# EAGLE design 2014-12-5_2.2_lcd_V1.0.0.4 (EAGLE 7.1.0)
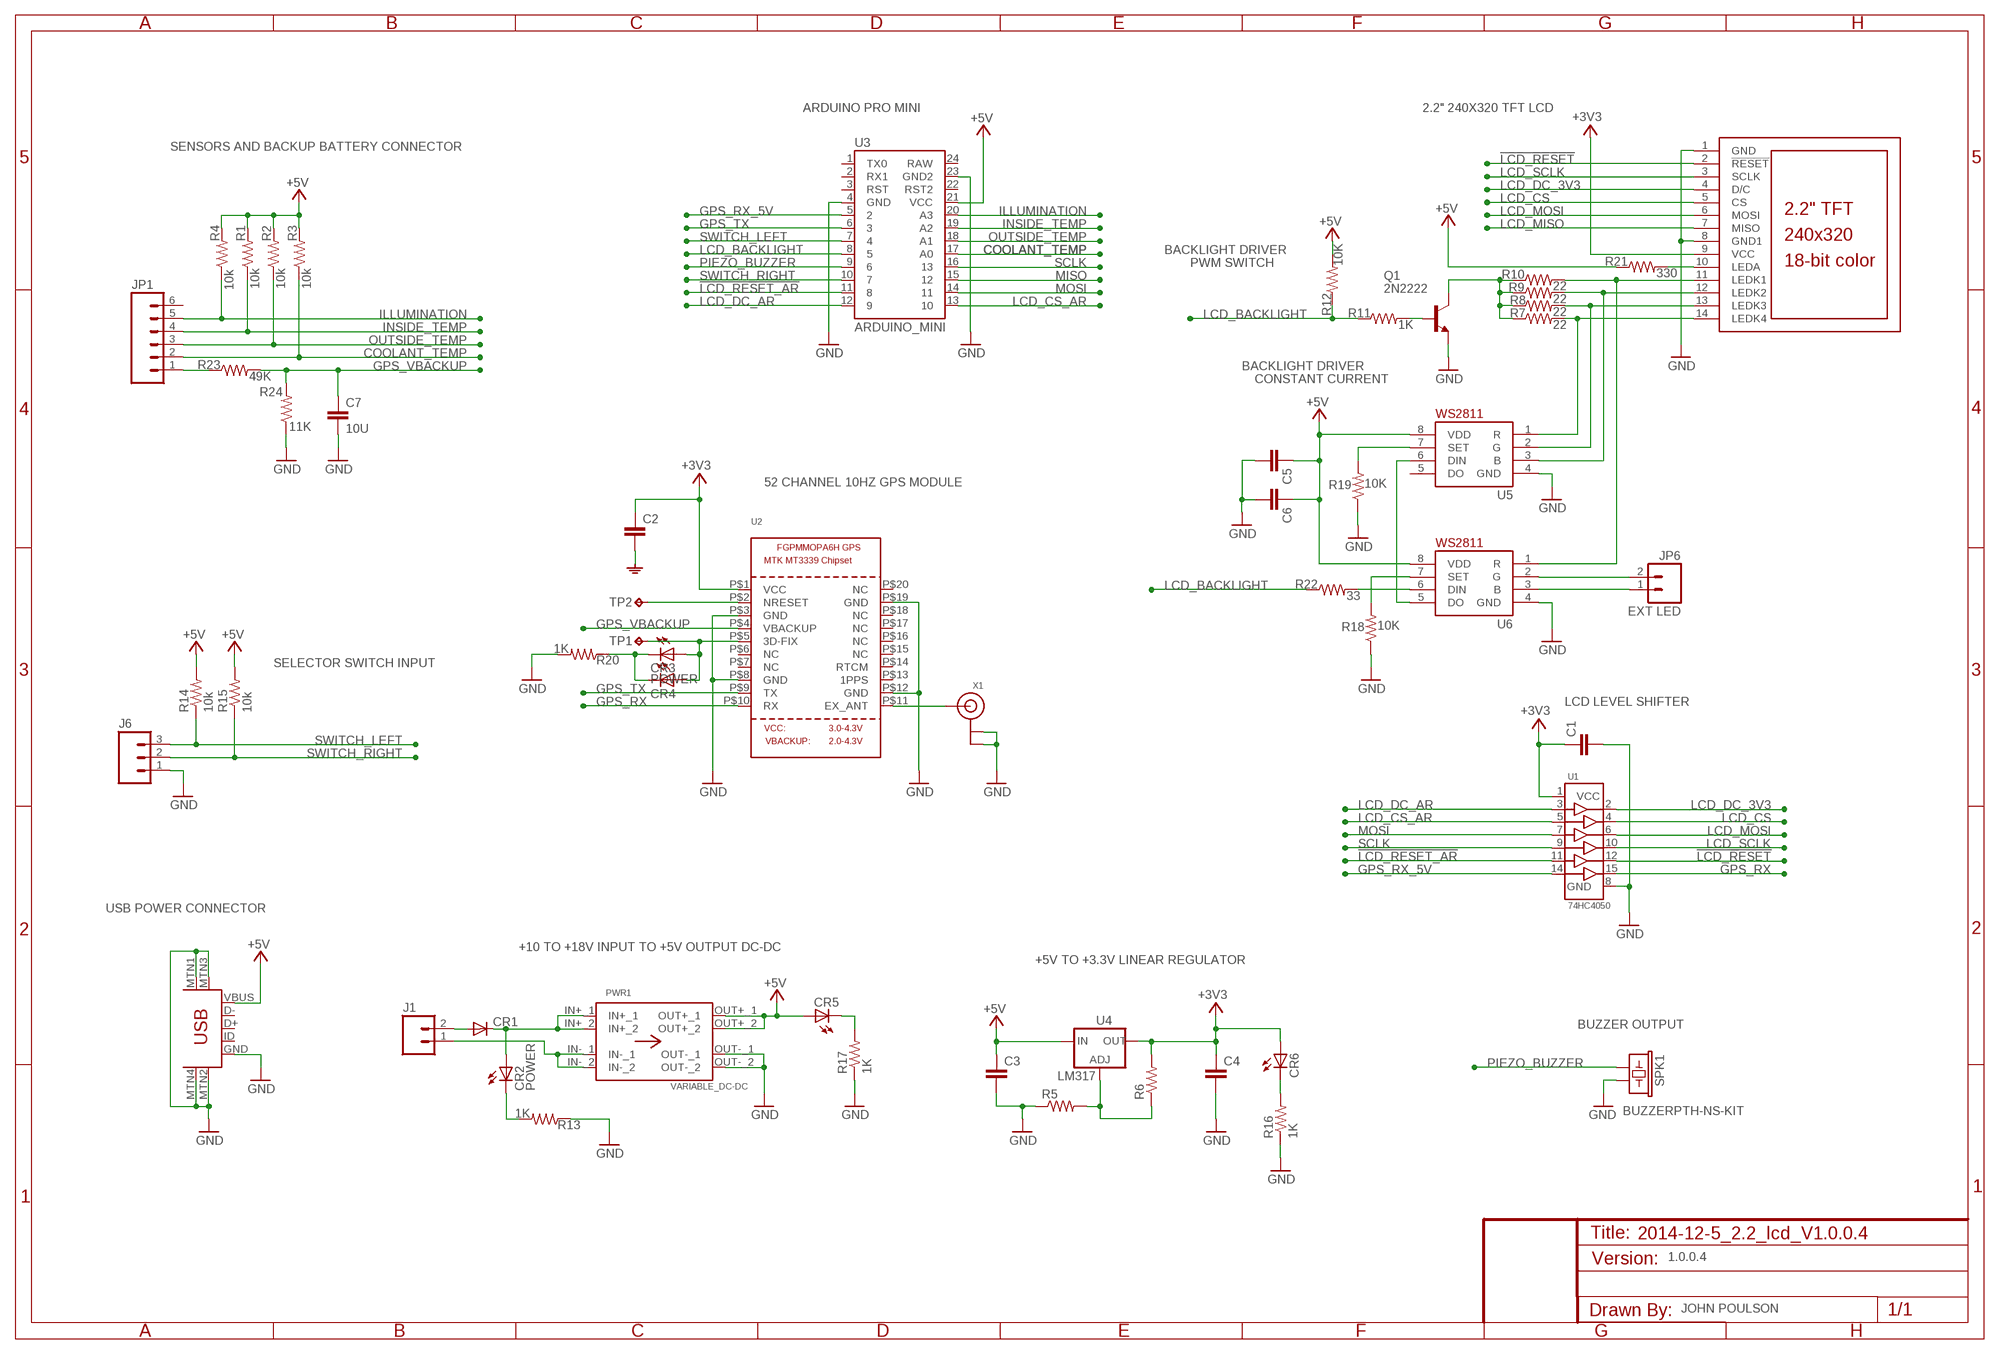
[diagram p0: schematic, sheet 1]

## Parts
C1  CAP0805  [0805]
C2  CAP0805  [0805]
C3  CAP0805  [0805]
C4  CAP0805  [0805]
C5  CAP0805  [0805]
C6  CAP0805  [0805]
C7  10U  CAP0805  [0805]
CR1  DIODESMB  [SMB-DIODE]
CR2  POWER  LED3MM  [LED3MM]
CR3  POWER  LED3MM  [LED3MM]
CR4  LED0603  [LED-0603]
CR5  LED0603  [LED-0603]
CR6  LED0603  [LED-0603]
J1  M02POLAR  [MOLEX-1X2]
J6  M03POLAR  [MOLEX-1X3]
JP1  M06POLAR  [MOLEX-1X6]
JP6  EXT LED  M02POLAR  [MOLEX-1X2]
PWR1  VARIABLE_DC-DC  [VARIABLE_DC-DC]
Q1  2N2222  [TO92]
R1  10k  RESISTOR0805-RES  [0805]
R2  10k  RESISTOR0805-RES  [0805]
R3  10k  RESISTOR0805-RES  [0805]
R4  10k  RESISTOR0805-RES  [0805]
R5  RESISTOR0805-RES  [0805]
R6  RESISTOR0805-RES  [0805]
R7  22  RESISTOR0805-RES  [0805]
R8  22  RESISTOR0805-RES  [0805]
R9  22  RESISTOR0805-RES  [0805]
R10  22  RESISTOR0805-RES  [0805]
R11  1K  RESISTOR0805-RES  [0805]
R12  10K  RESISTOR0805-RES  [0805]
R13  1K  RESISTOR0805-RES  [0805]
R14  10k  RESISTOR0805-RES  [0805]
R15  10k  RESISTOR0805-RES  [0805]
R16  1K  RESISTOR0805-RES  [0805]
R17  1K  RESISTOR0805-RES  [0805]
R18  10K  RESISTOR0805-RES  [0805]
R19  10K  RESISTOR0805-RES  [0805]
R20  1K  RESISTOR0805-RES  [0805]
R21  330  RESISTOR0805-RES  [0805]
R22  33  RESISTOR0805-RES  [0805]
R23  49K  RESISTOR0805-RES  [0805]
R24  11K  RESISTOR0805-RES  [0805]
SPK1  BUZZERPTH-NS-KIT  [BUZZER-12MM-NS-KIT]
TP1  TPPAD1-13  [P1-13]
TP2  TPPAD1-13  [P1-13]
U1  74HC4050  [SO16]
U2  GPS_FGPMMOPA6H  [FGPMMOPA6H]
U3  ARDUINO_MINI  [ARDUINO_MINI]
U4  LM317  V_REG_317SMD  [SOT223]
U5  WS2811-SOP8  [SO08-SKINNYPADS]
U6  WS2811-SOP8  [SO08-SKINNYPADS]
U$2  2.2_LCD  [2.2_LCD]
USB  USB-MINIB-5PIN  [USB-MINIB]
X1  ANTENNA_U.FL  [U.FL]

## Nets
!LCD_RESET: U1.12 U$2.2(!RESET)
!LCD_RESET_AR: U1.11 U3.11
+3V3: C1.1 C2.1 C4.1 CR6.A R6.2 U1.1(VCC) U2.P$1(VCC) U4.2(OUT) U$2.9(VCC)
+5V: C3.1 C5.1 C6.1 CR5.A PWR1.OUT+_1 PWR1.OUT+_2 R1.2 R2.2 R3.2 R4.2 R12.2 R14.2 R15.2 R21.1 U3.21(VCC) U4.3(IN) U5.8(VDD) U6.8(VDD) USB.VBUS
COOLANT_TEMP: JP1.2 R3.1 U3.17(A0)
GND: C1.2 C3.2 C4.2 C5.2 C6.2 C7.2 J6.1 PWR1.OUT-_1 PWR1.OUT-_2 Q1.1(E) R5.1 R13.1 R16.1 R17.1 R18.1 R19.1 R20.2 R24.1 SPK1.- U1.8(GND) U2.P$3(GND) U2.P$8(GND) U2.P$12(GND) U2.P$19(GND) U3.4(GND) U3.23(GND2) U5.4(GND) U6.4(GND) U$2.1(GND) U$2.8(GND1) USB.GND USB.MTN1(MTN2) USB.MTN2(MTN3) USB.MTN3(MTN1) USB.MTN4 X1.1(GND) X1.2(GND)
GPS_RX: U1.15 U2.P$10(RX)
GPS_RX_5V: U1.14 U3.5
GPS_TX: U2.P$9(TX) U3.6
GPS_VBACKUP: C7.1 R23.2 R24.2 U2.P$4(VBACKUP)
ILLUMINATION: JP1.5 R4.1 U3.20(A3)
INSIDE_TEMP: JP1.4 R1.1 U3.19(A2)
LCD_BACKLIGHT: R11.1 R12.1 R22.1 U3.8
LCD_CS: U1.4 U$2.5(CS)
LCD_CS_AR: U1.5 U3.13
LCD_DC_3V3: U1.2 U$2.4(D/C)
LCD_DC_AR: U1.3 U3.12
LCD_MISO: U$2.7(MISO)
LCD_MOSI: U1.6 U$2.6(MOSI)
LCD_SCLK: U1.10 U$2.3(SCLK)
MISO: U3.15
MOSI: U1.7 U3.14
N$1: TP2.TP U2.P$2(NRESET)
N$2: U2.P$11(EX_ANT) X1.3(SIGNAL)
N$3: R7.2 U5.1(R) U$2.14(LEDK4)
N$4: R8.2 U5.2(G) U$2.13(LEDK3)
N$5: R9.2 U5.3(B) U$2.12(LEDK2)
N$6: R5.2 R6.1 U4.1(ADJ)
N$7: R10.2 U6.1(R) U$2.11(LEDK1)
N$8: Q1.3(C) R7.1 R8.1 R9.1 R10.1
N$9: Q1.2(B) R11.2
N$10: CR1.A J1.2
N$11: CR1.C CR2.A PWR1.IN+_1 PWR1.IN+_2
N$12: J1.1 PWR1.IN-_1 PWR1.IN-_2
N$13: JP6.2 U6.2(G)
N$15: R21.2 U$2.10(LEDA)
N$16: CR3.K(C) CR4.C R20.1
N$17: CR2.K(C) R13.2
N$18: CR3.A CR4.A TP1.TP U2.P$5(3D-FIX)
N$19: CR6.C R16.2
N$20: CR5.C R17.2
N$21: U5.6(DIN) U6.5(DO)
N$22: R18.2 U6.7(SET)
N$23: JP6.1 U6.3(B)
N$24: R19.2 U5.7(SET)
N$25: R22.2 U6.6(DIN)
N$26: JP1.1 R23.1
OUTSIDE_TEMP: JP1.3 R2.1 U3.18(A1)
P$1: C2.2 ; supply symbol labelled GND
PIEZO_BUZZER: SPK1.+ U3.9
SCLK: U1.9 U3.16
SWITCH_LEFT: J6.3 R14.1 U3.7
SWITCH_RIGHT: J6.2 R15.1 U3.10
Unconnected: JP1.6 U2.P$6(NC) U2.P$7(NC) U2.P$13(1PPS) U2.P$14(RTCM) U2.P$15(NC) U2.P$16(NC) U2.P$17(NC) U2.P$18(NC) U2.P$20(NC) U3.1(TX0) U3.2(RX1) U3.3(RST) U3.22(RST2) U3.24(RAW) U5.5(DO) USB.D+ USB.D- USB.ID

## Notes on the sheet
- ARDUINO PRO MINI | 2.2" 240X320 TFT LCD
- SENSORS AND BACKUP BATTERY CONNECTOR
- BACKLIGHT DRIVER
- PWM SWITCH
- BACKLIGHT DRIVER
- CONSTANT CURRENT
- 52 CHANNEL 10HZ GPS MODULE
- SELECTOR SWITCH INPUT
- LCD LEVEL SHIFTER
- USB POWER CONNECTOR
- +10 TO +18V INPUT TO +5V OUTPUT DC-DC
- +5V TO +3.3V LINEAR REGULATOR
- BUZZER OUTPUT
- 1.0.0.4
- JOHN POULSON

## Library data of the parts
C1-C4 C7 = SparkFun-Passives:CAP: Capacitor Standard 0603 ceramic capacitor, and 0.1" leaded capacitor.
C5 C6 = SparkFun-Capacitors:CAP: Capacitor Standard 0603 ceramic capacitor, and 0.1" leaded capacitor.
CR1 = SparkFun-DiscreteSemi:DIODE: Diode These are standard reverse protection diodes and small signal diodes. SMA package can handle up to about 1A. SOD-323 can handle about 200mA. What the SOD-323 package when ordering, there are some mfgs out there that are 5-pin packages.
CR2-CR6 = SparkFun-LED:LED: LEDs Standard schematic elements and footprints for 5mm, 3mm, 1206, and 0603 sized LEDs. 5mm - Spark Fun Electronics SKU : COM-00529 (and others)
J1 JP6 = SparkFun-Connectors:M02: Header 2 Standard 2-pin 0.1" header. Use with straight break away headers (SKU : PRT-00116), right angle break away headers (PRT-00553), swiss pins (PRT-00743), machine pins (PRT-00117), and female headers (PRT-00115). Molex polarized connector foot print use with SKU : PRT-08233 with associated crimp pins and housings.
J6 = SparkFun-Connectors:M03: Header 3 Standard 3-pin 0.1" header. Use with straight break away headers (SKU : PRT-00116), right angle break away headers (PRT-00553), swiss pins (PRT-00743), machine pins (PRT-00117), and female headers (PRT-00115). Molex polarized connector foot print use with SKU : PRT-08232 with associated crimp pins and housings.
JP1 = SparkFun-Connectors:M06: Header 6 Standard 6-pin 0.1" header. Use with straight break away headers (SKU : PRT-00116), right angle break away headers (PRT-00553), swiss pins (PRT-00743), machine pins (PRT-00117), and female headers (PRT-00115). Molex polarized connector foot print use with SKU : PRT-08094 with associated crimp pins and housings. NOTES ON THE VARIANTS LOCK and LOCK_LONGPADS... This footprint was designed to help hold the alignment of a through-hole component (i.e. 6-pin header) while soldering it into place. You may notice that each hole has been shifted either up or down by 0.005 of an inch from it's more standard position (which is a perfectly straight line). This slight alteration caused the pins (the squares in the middle) to touch the edges of the holes. Because they are alternating, it causes a "brace" to hold the component in place. 0.005 has proven to be the perfect amount of "off-center" position when using our standard breakaway headers. Although looks a little odd when you look at the bare footprint, once you have a header in there, the alteration is very hard to notice. Also,if you push a header all the way into place, it is covered up entirely on the bottom side. This idea of altering the position of holes to aid alignment will be further integrated into the Sparkfun Library for other footprints. It can help hold any component with 3 or more connection pins.
PWR1 = !EXTRON:VARIABLE_DC-DC
Q1 = adafruit:2N2222: NPN TRANSISTOR Big oval pads
R1-R24 = SparkFun-Passives:RESISTOR: Resistor Basic schematic elements and footprints for 0603, 1206, and PTH resistors.
SPK1 = SparkFun-Electromechanical:BUZZER: Buzzer 12mm Spark Fun Electronics SKU : Comp-Buzzer
TP1 TP2 = testpad:TP: Test pad
U1 = !EXTRON:74HC4050
U2 = adafruit:GPS_FGPMMOPA6H: GPS Module - MTK MT3339 Chipset, -165dBm sensitivity, 22 channels, 10Hz, auto-select external antenna options
U3 = SparkFun-Boards:ARDUINO_MINI: Arduino Pro Mini footprint
U4 = SparkFun-PowerIC:V_REG_317: Voltage Regulator Standard LM317 adjustable voltage regulator. AOI (Adjust Output Input). Google 'LM317 Calculator' for easy to use app to get the two resistor values needed. 240/720 for 5V output. 240/390 for 3.3V output. Spark Fun Electronics SKU : COM-00527
U5 U6 = adafruit:WS2811
U$2 = !EXTRON:2.2_LCD
USB = SparkFun-Connectors:USB-MINIB: Mini-USB "B" connector with 5th pin broken out. Created new symbol breaking out 5th "ID" pin in mini/micro USB connector spec. See: http://en.wikipedia.org/wiki/Mini_usb#Cables. Uses same footprint as 4-pin symbol. Also added pins to connect to mounting / shield pads if required (probably not generally needed as signals aren't shielded once they leave the connector).
X1 = adafruit:ANTENNA_U.FL: U.FL Antenna Connector

## Board
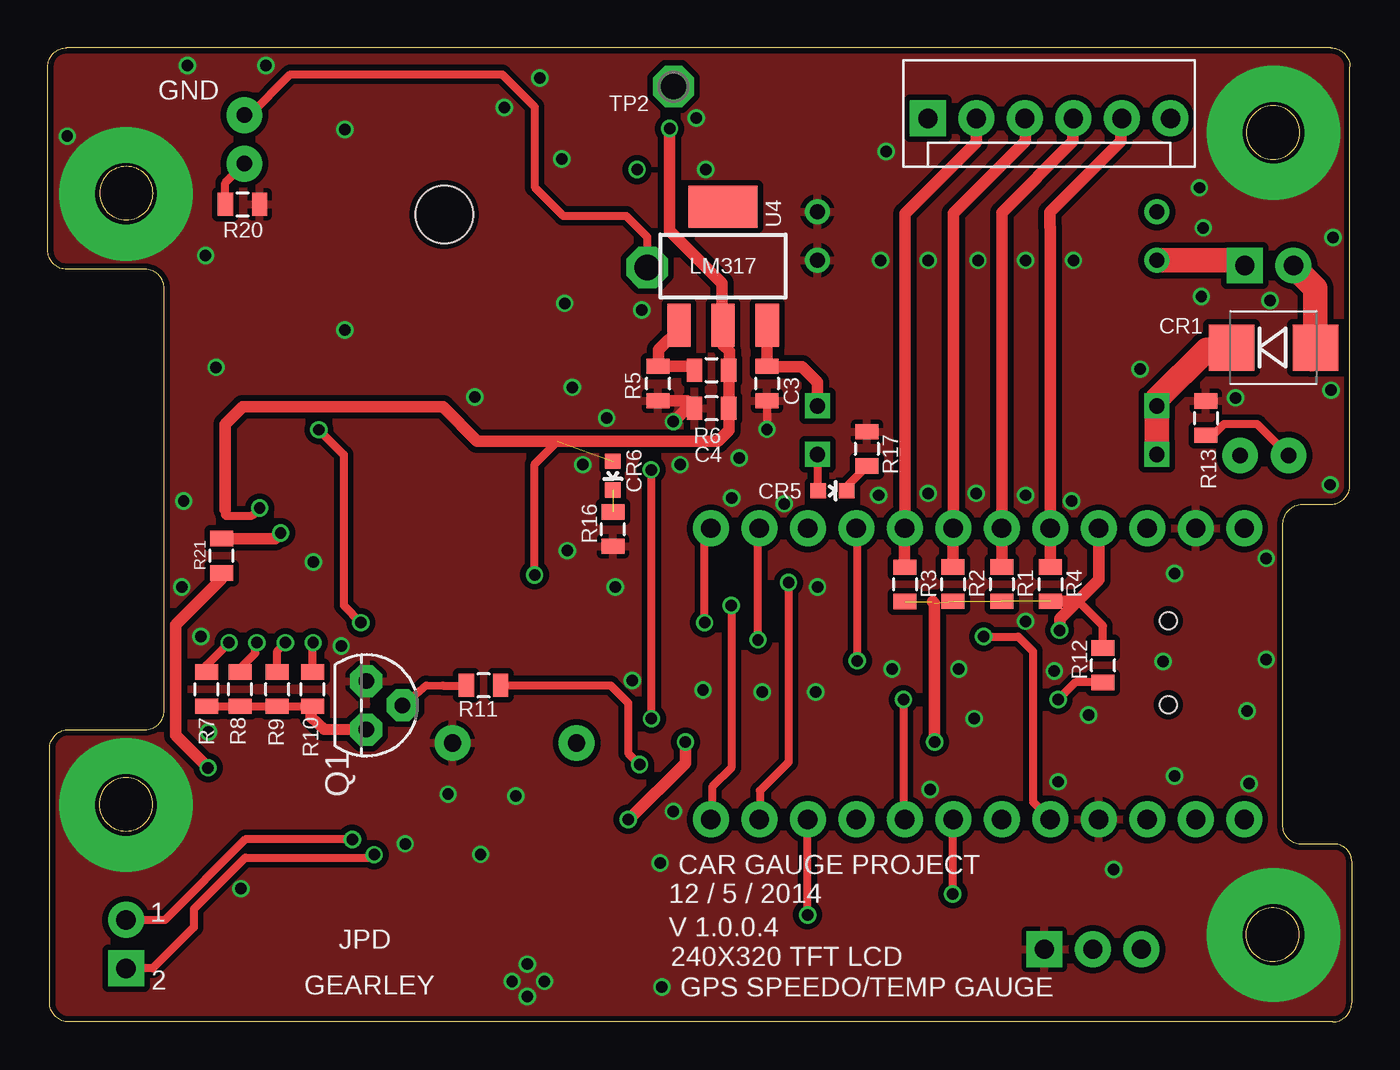
[diagram p1: board, top side]
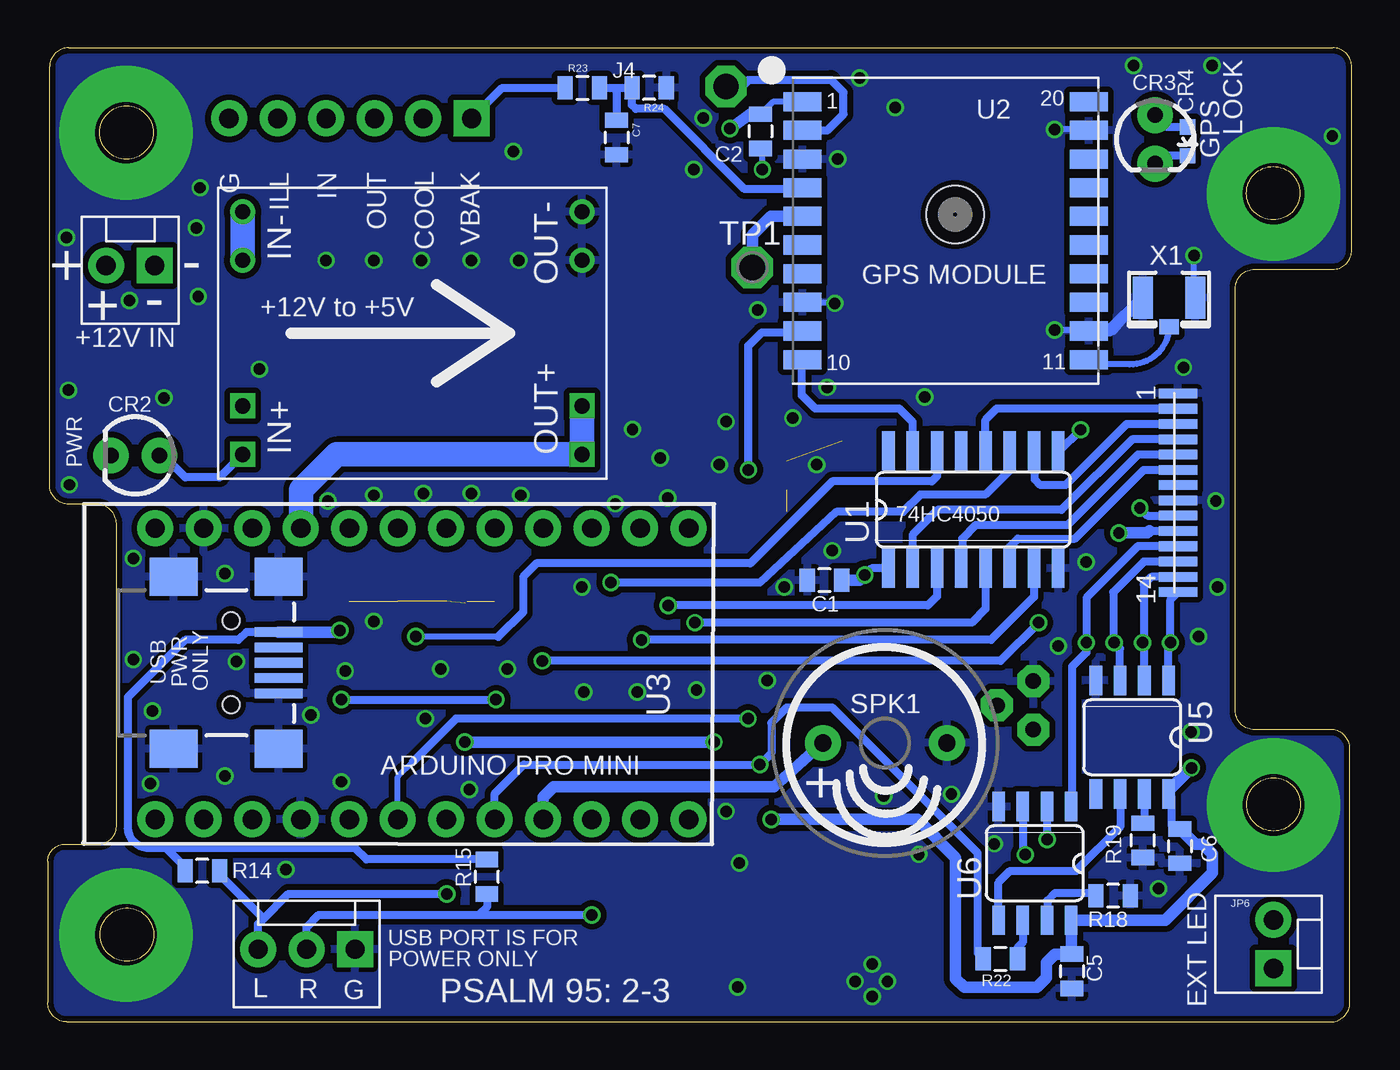
[diagram p2: board, bottom side, seen from below]

Size 68.3 x 51 mm. Coordinates in mm from the lower left corner, seen from the top.
Outline: 5.52,43.39 arc180 2.71,43.39 arc180 5.52,43.39
Outline: 5.5,11.39 arc180 2.7,11.39 arc180 5.5,11.39
Outline: 65.55,4.56 arc180 62.75,4.56 arc180 65.55,4.56
Outline: 65.58,46.56 arc180 62.78,46.56 arc180 65.58,46.56
Outline: 68.2,28.1 68.2,50 arc90 67.2,51 1,51 arc90 0,50 0,40.4 arc90 1,39.4 5.1,39.4 arc-90 6.1,38.4 6.1,16.3 arc-90 5.1,15.3 1.1,15.3 arc90 0.1,14.3 0.1,1 arc90 1.1,0 67.3,0 arc90 68.3,1 68.3,8.4 arc90 67.4,9.3 65.6,9.3 arc-90 64.7,10.3 64.7,26 arc-90 65.7,27.1 67.2,27.1 arc90 68.2,28.1
Copper layers (1*16): Top 0.035mm / dielectric 1.5mm / Bottom 0.035mm
Design rules "dirt_cheap_dirty_boards.v1": minimum track width 5mil, minimum drill 12mil, track to track 5mil, track to pad 5mil, pad to pad 5mil, via to via 5mil, smd to smd 0mil, copper to edge 10mil, drill to drill 10mil, minimum pad ring 10mil, minimum via ring 6mil, stop-mask expansion 2mil, vias tented up to drill 25mil, thermal gap 10mil

### Footprints (pad centres in the part's own frame; a part is rotated, then mirrored left to right if it is on the bottom)
0805 = smd 0.8 x 1.2: 1 -0.9,0; 2 0.9,0
SMB-DIODE = smd 2.4 x 2.4: A 2.2,0; C -2.2,0
LED3MM = drill 0.813 pad 1.88: A -1.27,0; K 1.27,0
LED-0603 = smd 0.8 x 0.8: A 0,-0.75; C 0,0.75
MOLEX-1X2 = drill 1.016 pad 1.88 square: 1 0,0 | drill 1.016 pad 1.88: 2 2.54,0
MOLEX-1X3 = drill 1.016 pad 1.88 square: 1 0,0 | drill 1.016 pad 1.88: 2 2.54,0; 3 5.08,0
MOLEX-1X6 = drill 1.016 pad 1.88 square: 1 0,0 | drill 1.016 pad 1.88: 2 2.54,0; 3 5.08,0; 4 7.62,0; 5 10.16,0; 6 12.7,0
VARIABLE_DC-DC = drill 0.8 square: IN+_1 -10.16,7.62; IN+_2 -7.62,7.62; OUT+_1 -10.16,-10.16; OUT+_2 -7.62,-10.16 | drill 0.8: IN-_1 0,7.62; IN-_2 2.54,7.62; OUT-_1 0,-10.16; OUT-_2 2.54,-10.16
TO92 = drill 0.813 pad 1.676 octagon: 1 -1.27,0; 2 0,1.905; 3 1.27,0
BUZZER-12MM-NS-KIT = drill 0.9 pad 1.88: + 3.25,0; - -3.25,0
P1-13 = drill 1.321 pad 2.159 octagon: TP 0,0
SO16 = smd 0.66 x 2.032: 1 -4.445,-3.073; 2 -3.175,-3.073; 3 -1.905,-3.073; 4 -0.635,-3.073; 5 0.635,-3.073; 6 1.905,-3.073; 7 3.175,-3.073; 8 4.445,-3.073; 9 4.445,3.073; 10 3.175,3.073; 11 1.905,3.073; 12 0.635,3.073; 13 -0.635,3.073; 14 -1.905,3.073; 15 -3.175,3.073; 16 -4.445,3.073
FGPMMOPA6H = smd 2 x 1: P$1 -7.5,6.75; P$2 -7.5,5.25; P$3 -7.5,3.75; P$4 -7.5,2.25; P$5 -7.5,0.75; P$6 -7.5,-0.75; P$7 -7.5,-2.25; P$8 -7.5,-3.75; P$9 -7.5,-5.25; P$10 -7.5,-6.75; P$11 7.5,-6.75; P$12 7.5,-5.25; P$13 7.5,-3.75; P$14 7.5,-2.25; P$15 7.5,-0.75; P$16 7.5,0.75; P$17 7.5,2.25; P$18 7.5,3.75; P$19 7.5,5.25; P$20 7.5,6.75 | hole 3: 0.5,0.85
ARDUINO_MINI = drill 1.016 pad 1.88: 1 -7.62,12.7; 2 -7.62,10.16; 3 -7.62,7.62; 4 -7.62,5.08; 5 -7.62,2.54; 6 -7.62,0; 7 -7.62,-2.54; 8 -7.62,-5.08; 9 -7.62,-7.62; 10 -7.62,-10.16; 11 -7.62,-12.7; 12 -7.62,-15.24; 13 7.62,-15.24; 14 7.62,-12.7; 15 7.62,-10.16; 16 7.62,-7.62; 17 7.62,-5.08; 18 7.62,-2.54; 19 7.62,0; 20 7.62,2.54; 21 7.62,5.08; 22 7.62,7.62; 23 7.62,10.16; 24 7.62,12.7
SOT223 = smd 1.219 x 2.235: 1 -2.311,-3.099; 2 0,-3.099; 3 2.311,-3.099 | smd 3.6 x 2.2: 4 0,3.099
SO08-SKINNYPADS = smd 0.66 x 1.524: 1 -1.905,-2.973; 2 -0.635,-2.973; 3 0.635,-2.973; 4 1.905,-2.973; 5 1.905,2.973; 6 0.635,2.973; 7 -0.635,2.973; 8 -1.905,2.973
2.2_LCD = smd 0.5 x 2: 1 5.2,-0.4; 2 4.4,-0.4; 3 3.6,-0.4; 4 2.8,-0.4; 5 2,-0.4; 6 1.2,-0.4; 7 0.4,-0.4; 8 -0.4,-0.4; 9 -1.2,-0.4; 10 -2,-0.4; 11 -2.8,-0.4; 12 -3.6,-0.4; 13 -4.4,-0.4; 14 -5.2,-0.4
USB-MINIB = smd 2.5 x 0.5: D+ 2.5,0; D- 2.5,0.8; GND 2.5,-1.6; ID 2.5,-0.8; VBUS 2.5,1.6 | smd 2.5 x 2: MTN1 -3,4.5; MTN2 2.5,4.5; MTN3 -3,-4.5; MTN4 2.5,-4.5 | hole 0.9: 0,2.2; 0,-2.2
U.FL = smd 2.2 x 1.05: 1 0,1.375; 2 0,-1.375 | smd 0.8 x 1: 3 1.525,0

### Placement (x,y rotation side)
C1  27.62,23.12 180 bottom
C2  30.97,46.62 270 bottom
C3  37.67,33.42 270 top
C4  34.77,32.12 180 top
C5  14.65,2.65 270 bottom
C6  9,9.2 270 bottom
C7  38.5,46.3 270 bottom
CR1  64.2,35.3 0 top
CR2  63.72,29.65 180 bottom
CR3  10.3,46.2 270 bottom
CR4  8.6,46.1 180 bottom
CR5  41.1,27.8 270 top
CR6  29.6,28.6 180 top
J1  62.7,39.6 180 bottom
J6  52.2,3.8 180 bottom
JP1  46.1,47.3 0 top
JP6  4.1,2.8 90 bottom
PWR1  50.47,39.87 90 bottom
Q1  16.68,16.57 270 top
R1  49.97,22.92 270 top
R2  47.42,22.92 270 top
R3  44.9,22.9 270 top
R4  52.52,22.92 270 top
R5  31.97,33.42 90 top
R6  34.77,34.12 0 top
R7  8.32,17.42 90 top
R8  10.07,17.42 90 top
R9  12.02,17.42 90 top
R10  13.87,17.42 90 top
R11  22.82,17.62 180 top
R12  55.27,18.67 90 top
R13  60.66,31.61 270 top
R14  60.2,7.9 180 bottom
R15  45.3,7.6 90 bottom
R16  29.6,25.8 90 top
R17  42.9,30 270 top
R18  12.5,6.6 180 bottom
R19  10.95,9.5 90 bottom
R20  10.2,42.8 0 top
R21  9.1,24.4 90 top
R22  18.4,3.3 0 bottom
R23  40.3,48.9 0 bottom
R24  36.8,48.9 180 bottom
SPK1  24.45,14.6 180 bottom
TP1  31.4,39.5 0 bottom
TP2  32.77,48.97 180 top
U1  19.82,26.82 0 bottom
U2  21.27,41.42 0 bottom
U3  49.97,18.22 90 bottom
U4  35.37,39.57 0 top
U5  11.5,14.9 180 bottom
U6  16.6,8.3 180 bottom
U$2  9.5,27.7 90 bottom
USB  58.7,18.8 0 bottom
X1  9.57,37.92 270 bottom

### Tracks (layer width: path | path; a pad name or v marks a point on that pad's centre or on a via)
!LCD_RESET
  Bottom 0.406: U1.12 19.18,31.52 18.6,32.1 U$2.2
!LCD_RESET_AR  (via drill 0.6)
  Top 0.406: v38.8,23 38.8,13.6 37.3,12.1 37.3,10.63 U3.11
  Bottom 0.406: U1.11 17.91,28.89 19.2,27.6 22.6,27.6 23.5,26.7 27,26.7 31,23 v38.8,23
+3V3  (via drill 0.6)  (1 unrouted)
  Top 0.406: v25.5,23.4 25.5,29.2 26.7,30.4 | 9.3,26.8 9.3,26.5 10.7,26.5 v11.1,26.9
  Top 0.61: v32.57,46.77 32.57,41.42 35.32,38.67 35.32,36.52 U4.2 35.37,35.43 35.7,35.1 35.7,34.15 R6.2 C4.1 35.67,30.97 35.1,30.4 26.7,30.4 22.5,30.4 20.7,32.2 10.2,32.2 9.3,31.3 9.3,26.8
  Bottom 0.305: U2.P$1 30.32,48.17 C2.1
  Bottom 0.406: U1.1 25.15,23.75 v25.5,23.4 | v11.1,26.9 10.7,26.5 U$2.9
  Bottom 0.61: C2.1 31.52,47.52 v32.57,46.77 | C1.1 25.78,23.12 v25.5,23.4
+5V  (via drill 0.6)  (4 unrouted)
  Top 0.406: v30.4,10.6 30.45,10.6 | 46.45,21.92 46.35,22.02 | CR5.A 40.35,29.67 PWR1.OUT+_1 | R12.2 55.27,20.73 53.95,22.05
  Top 0.61: U3.21 55.05,23.15 53.95,22.05 53.92,22.02 | 53.92,22.02 R4.2 | U4.3 C3.1 37.69,34.3 39.5,34.3 40.32,33.48 PWR1.OUT+_2 | 30.45,10.6 33.4,13.55 v33.4,14.65 | v46.45,14.65 46.45,21.92 | 46.33,22 46.35,22.02 | v53,20.5 53,21.1 53.92,22.02 | R21.1 9.1,23.2 6.7,20.8 6.7,15 v8.4,13.3
  Bottom 0.406: 62.1,9.1 52.2,9.1 51.6,8.5 R15.2 | 62.1,9.1 63,9.1 arc90 64.1,10.2 64.1,17 61.1,20 58.3,20 57.89,20.41 57.88,20.4 USB.VBUS | U5.8 9.45,11.78 9.45,10.4 | 9.45,10.4 C6.1 | 14.7,3.65 C5.1 14.7,3.75 | 9.45,10.4 9.45,10.3 | U6.8 | R14.2 61.1,8.1 62.1,9.1
  Bottom 0.61: v33.4,14.65 v46.45,14.65 | 14.7,3.75 U6.8 9.77,5.33 7.3,7.8 7.3,8.8 7.8,9.3 8.2,9.3 C6.1 | v30.4,10.6 22.75,10.6 20.75,8.6 20.75,2.25 20.3,1.8 16.5,1.8 16,2.3 16,3.1 15.55,3.55 C5.1 | 53.09,20.41 v53,20.5 53.1,20.4 USB.VBUS | U5.8 9.6,12.11 v8.4,13.3
  Bottom 1.27: U3.21 55.02,25.87 55.02,27.87 53.18,29.71 PWR1.OUT+_1 PWR1.OUT+_2
COOLANT_TEMP
  Top 0.61: R3.1 44.87,23.83 44.87,25.82 U3.17 44.89,40.6 44.9,40.61 44.9,42.3 48.64,46.04 JP1.2
GND  (via drill 0.6, 3.2 pad 7)
  Top 0.406: C3.2 v37.67,31.02
  Top 0.61: R5.1 33.47,32.52 C4.2 33.47,32.12 v32.77,31.42
  Bottom 0.305: X1.2 12.47,36.12 | X1.1 8.27,37.22 v8.27,40.12 | U2.P$12 14.57,36.22 v15.57,36.22 | U2.P$19 14.47,46.72 v15.57,46.72 | U2.P$8 27.22,37.67 v27.07,37.62
  Bottom 0.61: U2.P$12 12.7,36.17 X1.2
  other vias: 15.37,19.67 36.22,29.52 35.82,27.42 48.52,15.87 32.77,11.02 25.77,49.42 38.57,27.12 62.82,16.27 24.52,11.82 20.97,11.92 22.67,8.77 18.72,9.32 25.12,3.02 67.17,28.12 59.02,12.87 32.17,1.82 4.1,43.35 4.1,11.35 64.2,46.55 64.2,4.55 59.02,23.47 44.22,18.47 40.32,22.77 40.22,17.27 34.32,17.37 30.62,17.87 8.42,15.17 7.12,27.27 13.92,24.07 8.82,34.27 28.02,29.17 33.12,29.17 31.12,37.27 7.32,50.07 1.02,46.37 26.92,45.17 60.32,43.67 43.92,45.57 46.12,39.87 48.72,39.87 43.62,39.87 51.22,39.87 53.72,39.87 43.52,27.57 53.62,27.27 51.22,27.57 48.62,27.67 46.12,27.67 47.72,18.47 46.22,12.17 37.42,17.27 27.22,24.67 55.82,7.97 32.07,8.32 52.92,12.57 63.82,24.27 62.92,12.47 63.82,18.97 58.42,18.87 54.52,16.07 60.42,37.97 67.22,33.07 62.22,32.67 57.22,34.17 64.02,37.77 67.32,41.07 60.52,41.57 22.37,32.72 29.27,31.62 27.47,33.22 29.72,22.77 11.42,50.07 23.92,47.87 33.97,47.32 34.47,44.62 52.72,18.37 51.22,20.97 10.12,6.97 25.12,1.32 26.02,2.12 24.32,2.12 8.02,20.17 7.02,22.77
  pour Bottom (isolate 0.305): 0.17,50.97 68.12,50.92 68.12,0.12 0.22,0.17 0.15,50.99
  pour Top (isolate 0.305): 0.17,0.12 0.17,50.97 68.12,50.92 68.12,0.12
GPS_RX
  Bottom 0.406: U1.15 22.99,31.39 23.7,32.1 28.1,32.1 28.8,32.8 28.8,34.64 U2.P$10
GPS_RX_5V  (via drill 0.6)
  Top 0.406: 52.47,10.64 U3.5 51.6,11.51 51.6,19.4 50.83,20.17 v49.02,20.17
  Bottom 0.305: 52.47,10.64 U3.5 | 44.7,20.15 49,20.15 v49.02,20.17
  Bottom 0.406: U1.14 21.72,28.57 22,28.3 27.2,28.3 31.5,24 42.7,24 43.4,23.3 43.4,21.45 44.7,20.15
GPS_TX  (via drill 0.6)
  Top 0.406: v31.62,15.87 31.62,28.88 v31.6,28.9
  Bottom 0.305: U3.6 49.97,12.82 49.17,13.62 | 28.82,36.12 U2.P$9
  Bottom 0.406: v31.62,15.87 46.92,15.87 49.17,13.62 | v31.6,28.9 31.6,35.4 30.9,36.1 28.84,36.1 U2.P$9
GPS_VBACKUP
  Bottom 0.406: U2.P$4 28.84,43.6 31.8,43.6 36,47.8 37.5,47.8 37.7,48 R24.2 R23.2 38.7,48.9 38.5,48.7 C7.1
ILLUMINATION
  Top 0.61: R4.1 U3.20 52.51,41.59 52.5,41.6 52.5,42.4 56.2,46.1 56.2,47.24 JP1.5
INSIDE_TEMP
  Top 0.61: R1.1 U3.19 | U3.19 50.1,25.97 | JP1.4 53.7,47.28 53.7,46.1 49.97,42.37 U3.19
LCD_BACKLIGHT  (via drill 0.6)
  Top 0.406: v44.82,16.87 44.82,10.67 U3.8 | R11.1 29.48,17.62 30.4,16.7 30.4,14.07 v31,13.47 | R12.1 53.82,17.77 v52.92,16.87
  Bottom 0.406: U3.8 44.89,11.95 43.37,13.47 v31,13.47 30.4,14.07 30.4,15.65 29.6,16.45 27.2,16.45 19.6,8.85 19.6,3.6 R22.1 | v52.92,16.87 v44.82,16.87
LCD_CS
  Bottom 0.406: U$2.5 11.2,29.7 14.9,26 19.7,26 20.4,25.3 20.4,23.8 U1.4
LCD_CS_AR  (via drill 0.6)
  Top 0.406: 34.7,25.81 U3.13 34.4,25.51 v34.4,20.9
  Bottom 0.406: U1.5 19.18,21.61 19.9,20.9 v34.4,20.9
LCD_DC_3V3
  Bottom 0.406: U$2.4 11.5,30.5 15.2,26.8 21.7,26.8 23,25.5 U1.2
LCD_DC_AR  (via drill 0.6)
  Top 0.305: 34.77,10.64 U3.12
  Top 0.406: v35.8,21.8 35.8,13.3 34.8,12.3 34.8,10.67 U3.12
  Bottom 0.406: U1.3 21.72,22.27 22.2,21.8 v35.8,21.8
LCD_MOSI
  Bottom 0.406: U1.6 17.91,24.89 17.5,25.3 14.5,25.3 10.9,28.9 U$2.6
LCD_SCLK
  Bottom 0.406: U$2.3 11.8,31.3 15,28.1 16.3,28.1 16.6,28.4 16.6,29.85 U1.10
MOSI  (via drill 0.6)
  Top 0.406: v37.2,20 37.2,25.77 U3.14
  Bottom 0.406: U1.7 16.64,22.25 18.9,20 v37.2,20
N$1
  Bottom 0.406: U2.P$2 27.47,46.67 26.62,47.52 26.62,48.67 27.27,49.32 27.3,49.3 31.6,49.3 31.93,48.97 TP2.TP
N$2
  Bottom 0.305: X1.3 arc90 11.64,34.42 12.97,34.42 arc-90 13.22,34.67 U2.P$11
N$3  (via drill 0.6)
  Top 0.406: R7.2 8.32,18.67 v9.5,19.85
  Bottom 0.406: U5.1 9.6,19.8 v9.5,19.85 9.5,22.1 U$2.14
N$4  (via drill 0.6)
  Top 0.406: R8.2 10.07,18.5 10.87,19.3 10.87,19.77 v10.95,19.85
  Bottom 0.406: U5.2 10.87,19.77 v10.95,19.85 10.9,19.9 10.9,22.9 10.5,23.3 U$2.13
N$5  (via drill 0.6)
  Top 0.406: R9.2 12.02,19.42 v12.45,19.85
  Bottom 0.406: U5.3 12.13,19.54 v12.45,19.85 12.5,19.9 12.5,22.5 10.9,24.1 U$2.12
N$6
  Top 0.61: U4.1 33.06,35.73 33.07,35.72 32.52,35.72 32,35.2 32,34.35 R5.2 33.67,34.32 R6.1
N$7  (via drill 0.6)
  Top 0.406: R10.2 13.87,19.82 v13.9,19.85
  Bottom 0.406: U6.1 14.65,11.32 14.65,18.6 13.9,19.35 v13.9,19.85 13.9,22.2 11.2,24.9 U$2.11
N$8
  Top 0.406: R7.1 R8.1 R9.1 R10.1 13.95,16.44
  Top 0.61: Q1.3 14.47,15.33 13.8,15.95 13.8,16.45 R10.1
N$9
  Top 0.406: Q1.2 19.82,17.62 20.7,17.6 21.9,17.6 R11.2
N$10
  Top 1.27: 66.4,35.5 CR1.A | J1.2 65.24,39.56 66.4,38.4 CR1.A | CR1.A 66.4,34.9 66.2,34.7 66.2,35.1 CR1.A
N$11
  Top 1.27: PWR1.IN+_1 PWR1.IN+_2 58.09,32.59 60.7,35.2 61.9,35.2 CR1.C
  Bottom 0.406: PWR1.IN+_1 59.3,28.5 61.1,28.5 62.25,29.65 CR2.A
N$12
  Top 1.27: PWR1.IN-_1 62.43,39.87 J1.1
  Bottom 1.27: PWR1.IN-_2 PWR1.IN-_1
N$13  (via drill 0.6)
  Top 0.406: v15.95,9.55 10.35,9.55 6.14,5.34 JP6.2
  Bottom 0.406: U6.2 15.97,9.56 v15.95,9.55
N$15  (via drill 0.6)
  Top 0.61: R21.2 11.9,25.3 v12.2,25.6
  Bottom 0.406: 10.6,25.7 U$2.10
  Bottom 0.61: v12.2,25.6 10.7,25.6 10.6,25.7
N$16
  Top 0.406: R20.1 9.3,43.93 CR3.K
  Bottom 0.406: CR4.C 9.88,45.35 CR3.K
N$17
  Top 0.406: CR2.K 63.34,31.3 61.6,31.3 61.01,30.71 R13.2
N$18
  Top 0.406: TP1.TP 31.4,41.1 30.3,42.2 27,42.2 25.5,43.7 25.5,47.9 23.8,49.6 12.7,49.6 10.57,47.47 CR3.A
  Bottom 0.406: CR4.A 9.68,46.85 CR3.A
  Bottom 0.61: U2.P$5 30.43,42.17 31.4,41.2 TP1.TP
N$19  (1 unrouted)
N$20
  Top 0.406: CR5.C 41.85,28.05 R17.2
N$21
  Bottom 0.406: U6.5 18.5,7.29 17.9,7.9 14.45,7.9 12.1,10.25 12.1,11.89 U5.6
N$22
  Bottom 0.406: U6.7 15.95,5.34 15.95,6.35 15.55,6.75 13.55,6.75 R18.2
N$23  (via drill 0.6)
  Top 0.406: v17.1,8.75 16.95,8.6 10.35,8.6 7.65,5.9 7.65,4.95 5.5,2.8 JP6.1
  Bottom 0.406: U6.3 17.23,8.88 v17.1,8.75
N$24
  Bottom 0.406: U5.7 10.87,10.48 R19.2
N$25
  Bottom 0.406: R22.2 17.5,3.9 17.2,4.2 17.2,5.29 U6.6
N$26
  Bottom 0.406: JP1.1 44.5,48.9 R23.1
OUTSIDE_TEMP
  Top 0.61: R2.1 U3.18 47.43,42.33 51.2,46.1 51.2,46.79 51.18,46.81 JP1.3
P$1  (via drill 0.6)
  Bottom 0.305: C2.2 30.87,45.7 30.87,45.05 v30.87,44.62
PIEZO_BUZZER
  Bottom 0.61: U3.9 42.35,11.75 41.8,12.3 30.25,12.3 SPK1.+
SCLK  (via drill 0.6)
  Top 0.305: 42.37,25.82 U3.16
  Top 0.406: v42.4,18.9 42.4,25.79 U3.16 | 16.3,21 v16.4,20.9 15.5,21.8 15.5,29.7 v14.2,31
  Bottom 0.406: v16.4,20.9 18.4,18.9 v42.4,18.9 | U1.9 15.31,29.89 v14.2,31
SWITCH_LEFT  (via drill 0.6)
  Top 0.406: v47.4,6.7 47.4,10.57 U3.7
  Bottom 0.406: 57,5.4 57.28,5.12 J6.3 | 57,5.4 55.7,6.7 v47.4,6.7 | R14.1 59.3,7.7 57,5.4
SWITCH_RIGHT  (via drill 0.6)
  Top 0.406: v39.8,5.6 U3.10
  Bottom 0.406: 45.7,5.6 54.1,5.6 54.74,4.96 J6.2 | 45.7,5.6 v39.8,5.6 | R15.1 45.3,6 45.7,5.6

### Text on the board
tNames: GND | CAR GAUGE PROJECT | 12 / 5 / 2014 | 1 | JPD | V 1.0.0.4 | 240X320 TFT LCD | 2 | GEARLEY | GPS SPEEDO/TEMP GAUGE
bNames: 20 | J4 | 1 | LOCK | GPS | VBAK | COOL | OUT | IN | ILL | G | GPS MODULE | - | + | +12V to +5V | - | + | 11 | +12V IN | 10 | PWR | PWR | ONLY | ARDUINO PRO MINI | + | USB PORT IS FOR | POWER ONLY | PSALM 95: 2-3 | G | R | L